# EasyEDA Pro project Sprig-C3 V1.0.1.epro, board PCB8
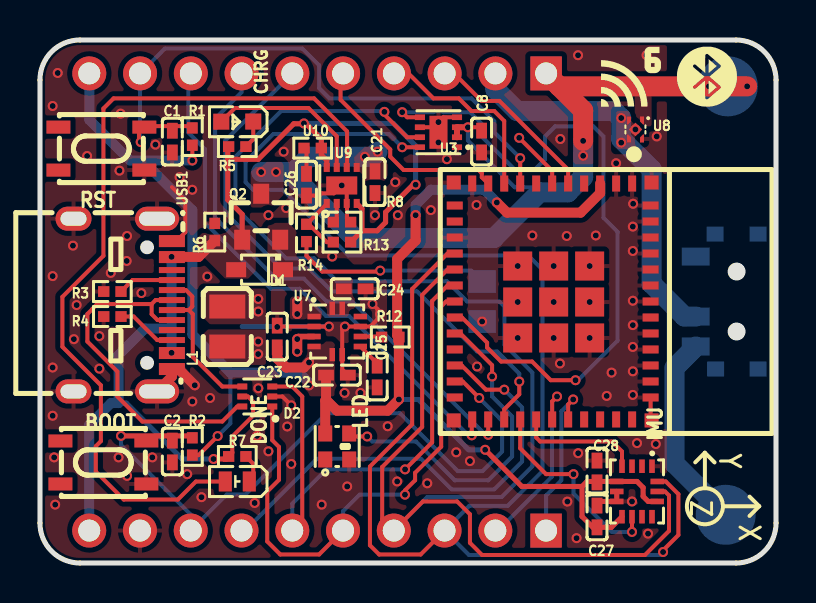
[diagram p12: board, top side]
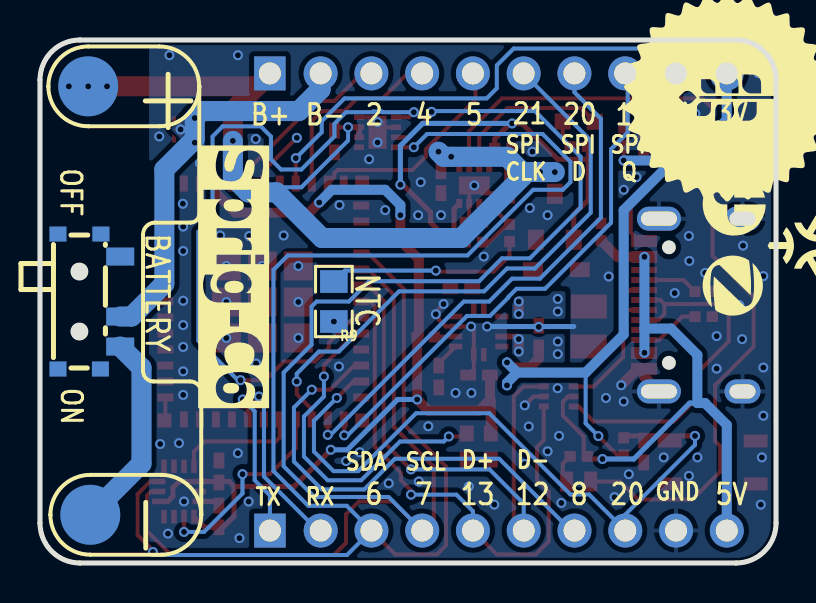
[diagram p13: board, bottom side, seen from below]

Outline 36.83 x 26.16 mm; copper layers: Top Layer, Bottom Layer. Coordinates in mm from the lower left corner of the outline.
Outline path: 0,24.16 0,2 arc(0.59,0.59) 2,0 34.83,0 arc(36.24,0.59) 36.83,2 36.83,24.16 arc(36.24,25.58) 34.83,26.16 2,26.16 arc(0.59,25.58) 0,24.16
Stack: Top Layer 0.035mm / Dielectric1 1.51mm FR4 er 4.5 / Bottom Layer 0.035mm

## Design rules (mm)
template: Custom Config
spacing copperThickness1oz (default): track to track 0.102, other pairs 0.152 to 0.3
spacing copperThickness2oz: track to track 0.203, other pairs 0.152 to 0.3
track width copperThickness1oz (default): min 0.127, default 0.254, max 2.54
track width copperThickness2oz: min 0.203, default 0.254, max 2.54
differential pair differentialPair (default): width min 0.127, default 0.254, max 2.54; gap min 0.152, default 0.152
via viaSize (default): diameter min 0.5, default 0.61, max 10; hole min 0.3, default 0.305, max 6.3
net VBAT uses solid
net VIN uses solid
net VCC uses solid
net 3.3V uses solid
net B- uses solid
net $2N1928 uses solid
net $2N1927 uses solid

## Placement (name value [footprint] x y rotation side)
BOOT  TSA016A2518C  [SW-SMD_4P-L4.2-W3.3-P2.15-LS4.6]  3.17 5.03 0 top
C1  100nF  [C0402]  6.62 21.08 90 top
C2  100nF  [C0402]  6.62 5.58 90 top
C8  100nF  [C0402]  22.1 21.08 90 top
C21  10uF  [C0402]  16.76 19.05 90 top
C22  22uF  [C0402]  14.86 9.4 180 top
C23  22uF  [C0402]  11.87 11.33 270 top
C24  22uF  [C0402]  15.75 13.72 180 top
C25  1nF  [C0402]  16.87 9.33 90 top
C26  10uF  [C0402]  13.33 18.92 90 top
C27  100nF  [C0402]  27.87 2.33 270 top
C28  100nF  [C0402]  27.87 4.58 90 top
CHRG  NCD0603O3  [LED0603-RD]  9.87 22.08 180 top
D1  1N5819WS  [SOD-323_L1.8-W1.3-LS2.5-RD]  10.99 14.67 180 top
D2  USBLC6-2P6  [SOT-666-6_L1.6-W1.2-P0.50-LS1.6-BL]  10.87 8.33 90 top
DONE  F.0603.00048/P2-0603W6YS2-06T-002  [LED-SMD_L1.6-W0.8-RD-WHITE-2]  9.87 4.08 180 top
H3  DZ254R-11-10-63  [HDR-TH_10P-P2.54-V-M]  13.89 1.62 180 top
H4  DZ254R-11-10-63  [HDR-TH_10P-P2.54-V-M]  13.9 24.49 180 top
IMU  BMI260  [LGA-14_L3.0-W2.5-P0.50-TL]  29.87 3.58 270 top
L1  1.5uH  [L0806]  9.37 11.83 90 top
LED  SK6805D-EC2018  [LED-SMD_4P-L2.0-W1.8-BL_SK6805D]  14.87 5.83 0 top
NOREF  -  [Pad_e5538]  34.31 2.41 180 top
NOREF#2  -  [Pad_e5537]  34.42 23.84 180 top
Q2  AO3401A  [SOT-23_L2.9-W1.3-P1.90-LS2.4-BR]  11.07 17.32 270 top
R1  10kΩ  [R0402]  7.62 21.33 270 top
R2  10kΩ  [R0402]  7.62 5.83 270 top
R3  5.1kΩ  [R0402]  3.62 13.58 180 top
R4  5.1kΩ  [R0402]  3.62 12.33 0 top
R5  680Ω  [R0402]  9.87 20.83 0 top
R6  10kΩ  [R0402]  8.75 16.55 270 top
R7  200Ω  [R0402]  9.87 5.33 0 top
R8  2kΩ  [R0402]  15.11 17.05 180 top
R9  FNTC0805X104F4250FB  [R0805]  22.12 13.08 90 bottom
R12  1MΩ  [R0402]  17.53 11.3 0 top
R13  100kΩ  [R0402]  15.11 16.05 180 top
R14  62kΩ  [R0402]  13.33 16.51 90 top
RST  TSA016A2518C  [SW-SMD_4P-L4.2-W3.3-P2.15-LS4.6]  3.07 20.73 0 top
SW3  MK-12C03-G015  [SW-SMD_MK-12C03-G015]  34.37 13.08 270 bottom
U1  ESP32-C6-MINI-1-N4  [WIFIM-SMD_61P-L16.6-W13.2-P0.80-ESP32-C6-MINI-1-N4]  25.65 13.08 270 top
U3  MAX17048G+T10  [DFN-8_L2.0-W2.0-P0.50-BL-EP]  19.94 21.55 90 top
U7  TPS63051RMWR  [QFN-12_L2.5-W2.5-P0.50-TL]  14.87 11.58 0 top
U8  AP6683  [DFN-4_L1.0-W1.0-P0.65-BL-EP]  29.8 21.69 180 top
U9  LGS4056H  [DFN-8_L2.0-W2.0-P0.50-TL-EP1.6]  15.1 18.89 90 top
U10  1Ω  [R0402]  13.65 20.75 180 top
USB1  U262-161N-4BVC11  [USB-3.1-SMD_U262-161N-4BVC11]  4.14 12.9 270 top

## Footprints (pads in the part's own frame, mm; a bottom-side part is the same pattern mirrored in y, then rotated)
C0402
  rect 0.79x0.54 smd: 1(-0.545,0) 2(0.545,0)
DFN-4_L1.0-W1.0-P0.65-BL-EP
  custom 0.2x0.4 smd: 1(-0.325,-0.475) 2(0.325,-0.474) 3(0.325,0.475) 4(-0.325,0.475)
  rect 0.48x0.48 smd rot 45: 5(0.004,0.001)
DFN-8_L2.0-W2.0-P0.50-BL-EP
  rect 0.28x0.505 smd: 1(-0.75,-0.927) 2(-0.25,-0.927) 3(0.25,-0.927) 4(0.75,-0.927) 5(0.75,0.927) 6(0.25,0.927) 7(-0.25,0.927) 8(-0.75,0.927)
  rect 1.65x0.9 smd: 9(0,0)
DFN-8_L2.0-W2.0-P0.50-TL-EP1.6
  rect 0.45x0.3 smd: 1(-0.9,0.75) 2(-0.9,0.25) 3(-0.9,-0.25) 4(-0.9,-0.75) 5(0.9,-0.75) 6(0.9,-0.25) 7(0.9,0.25) 8(0.9,0.75)
  rect 0.9x1.55 smd: 9(-0.001,0.002)
HDR-TH_10P-P2.54-V-M
  rect 1.575x1.7 hole 1.1: 1(-11.43,0)
  round 1.7 hole 1.1: 2(-8.89,0) 3(-6.35,0) 4(-3.81,0) 5(-1.27,0) 6(1.27,0) 7(3.81,0) 8(6.35,0) 9(8.89,0) 10(11.43,0)
L0806
  rect 1.2x1.8 smd: 1(-1,0) 2(1,0)
LED0603-RD
  rect 0.8x0.8 smd: 1(-0.799,-0.004) 2(0.799,0.004)
LED-SMD_4P-L2.0-W1.8-BL_SK6805D
  rect 0.7x0.8 smd: 1(-0.6,-0.65) 2(0.6,-0.65) 3(0.6,0.65) 4(-0.6,0.65)
LED-SMD_L1.6-W0.8-RD-WHITE-2
  rect 0.65x1 smd: 1(-0.6,0) 2(0.6,0)
LGA-14_L3.0-W2.5-P0.50-TL
  rect 0.675x0.28 smd: 1(-1.262,0.75) 2(-1.262,0.25) 3(-1.262,-0.25) 4(-1.262,-0.75) 8(1.262,-0.75) 9(1.262,-0.25) 10(1.262,0.25) 11(1.262,0.75)
  rect 0.28x0.675 smd: 5(-0.5,-1.012) 6(0,-1.012) 7(0.5,-1.012) 12(0.5,1.012) 13(0,1.012) 14(-0.5,1.012)
Pad_e5537
  round 3 smd far side: 1(0,0)
Pad_e5538
  round 3 smd far side: 2(0,0)
QFN-12_L2.5-W2.5-P0.50-TL
  rect 0.665x0.28 smd: 1(-1.157,0.75) 2(-1.157,0.25) 3(-1.157,-0.25) 4(-1.157,-0.75) 7(1.157,-0.75) 8(1.157,-0.25) 9(1.157,0.25) 10(1.157,0.75)
  rect 0.28x0.665 smd: 5(-0.25,-1.157) 6(0.25,-1.157) 11(0.25,1.157) 12(-0.25,1.157)
R0402
  rect 0.566x0.54 smd: 1(-0.433,0) 2(0.433,0)
R0805
  rect 1.133x1.377 smd: 1(-1,0) 2(1,0)
SOD-323_L1.8-W1.3-LS2.5-RD
  rect 1x0.75 smd: 1(-1.173,0) 2(1.173,0)
SOT-23_L2.9-W1.3-P1.90-LS2.4-BR
  rect 1x0.8 smd: 1(1.15,-0.95) 2(1.15,0.95) 3(-1.15,0)
SOT-666-6_L1.6-W1.2-P0.50-LS1.6-BL
  rect 0.3x0.5 smd: 1(-0.5,-0.75) 2(0,-0.75) 3(0.5,-0.75) 4(0.5,0.75) 5(0,0.75) 6(-0.5,0.75)
SW-SMD_4P-L4.2-W3.3-P2.15-LS4.6
  rect 1.2x0.65 smd: 1(-2.15,1.075) 2(2.15,1.075) 3(-2.15,-1.075) 4(2.15,-1.075)
SW-SMD_MK-12C03-G015
  rect 0.9x1.4 smd: 1(-2.251,1.558) 2(0.75,1.558) 3(2.25,1.558)
  rect 0.75x0.85 smd: 4(-3.375,0.592) 5(-3.375,-1.558) 6(3.375,0.567) 7(3.375,-1.558)
USB-3.1-SMD_U262-161N-4BVC11
  rect 0.6x1.3 smd: A1B12(-3.2,2.462) A4B9(-2.4,2.462) B1A12(3.2,2.462) B4A9(2.4,2.462)
  rect 0.3x1.3 smd: A5(-1.25,2.462) A6(-0.25,2.462) A7(0.25,2.462) A8(1.25,2.462) B5(1.75,2.462) B6(0.75,2.462) B7(-0.75,2.462) B8(-1.75,2.462)
  oval 1.2x2.2 hole 0.7x1.8: SHELL(-4.32,1.719) SHELL(4.32,1.719)
  oval 1.2x1.8 hole 0.7x1.3: SHELL(-4.32,-2.462) SHELL(4.32,-2.462)
WIFIM-SMD_61P-L16.6-W13.2-P0.80-ESP32-C6-MINI-1-N4
  rect 0.8x0.4 smd: 1(-5.9,3.975) 2(-5.9,3.175) 3(-5.9,2.375) 4(-5.9,1.575) 5(-5.9,0.775) 6(-5.9,-0.025) 7(-5.9,-0.825) 8(-5.9,-1.625) 9(-5.9,-2.425) 10(-5.9,-3.225) 11(-5.9,-4.025) 25(5.9,-4.025) 26(5.9,-3.225) 27(5.9,-2.425) 28(5.9,-1.625) 29(5.9,-0.825) 30(5.9,-0.025) 31(5.9,0.775) 32(5.9,1.575) 33(5.9,2.375) 34(5.9,3.175) 35(5.9,3.975)
  rect 0.4x0.8 smd: 12(-4.8,-4.9) 13(-4,-4.9) 14(-3.2,-4.9) 15(-2.4,-4.9) 16(-1.6,-4.9) 17(-0.8,-4.9) 18(0,-4.9) 19(0.8,-4.9) 20(1.6,-4.9) 21(2.4,-4.9) 22(3.2,-4.9) 23(4,-4.9) 24(4.8,-4.9) 36(4.8,4.9) 37(4,4.9) 38(3.2,4.9) 39(2.4,4.9) 40(1.6,4.9) 41(0.8,4.9) 42(0,4.9) 43(-0.8,4.9) 44(-1.6,4.9) 45(-2.4,4.9) 46(-3.2,4.9) 47(-4,4.9) 48(-4.8,4.9)
  rect 1.45x1.45 smd: 49(-1.775,1.85) 49(-1.775,0.05) 49(-1.775,-1.75) 49(0.025,1.85) 49(0.025,0.05) 49(0.025,-1.75) 49(1.825,1.85) 49(1.825,0.05) 49(1.825,-1.75)
  rect 0.7x0.7 smd: 50(5.95,4.95) 51(5.95,-4.95) 52(-5.95,-4.95) 53(-5.95,4.95)

## Nets
3.3V: C22.2 C23.2 C27.2 C28.1 H4.10 IMU.5 IMU.8 IMU.12 LED.4 R1.2 R2.2 R12.2 U1.3 U7.4 U7.5
GND: BOOT.4 C1.1 C2.1 C8.1 C21.1 C22.1 C23.1 C24.1 C25.1 C26.1 C27.1 C28.2 D2.2 H3.9 IMU.1 IMU.6 IMU.7 LED.2 R3.2 R4.1 R6.1 R8.1 R9.1 RST.4 U1.1 U1.2 U1.11 U1.14 U1.36 U1.37 U1.38 U1.39 U1.40 U1.41 U1.42 U1.43 U1.44 U1.45 U1.46 U1.47 U1.48 U1.49 U1.50 U1.51 U1.52 U1.53 U3.1 U3.4 U3.6 U3.9 U7.2 U7.6 U7.9 U8.4 U9.3 U9.9 USB1.A1B12 USB1.B1A12 USB1.SHELL
VBAT: C8.2 C21.2 H4.1 NOREF#2.1 Q2.3 U3.2 U3.3 U8.1 U9.5
VCC: D1.2 D2.5 H3.10 Q2.1 R5.1 R6.2 R7.1 R13.1 U9.4 U9.8 U10.1 USB1.A4B9 USB1.B4A9
VIN: C24.2 D1.1 Q2.2 U7.11 U7.12
ALRT: U1.19 U3.5
B-: H4.2 SW3.2 U8.2 U8.3 U8.5
B-_C: NOREF.2 SW3.3
BUSY: U1.12
D02: H4.3 U1.5
D04: H4.4 U1.9
D05: H4.5 U1.10
D08: H3.7 U1.22
D09: BOOT.2 C2.2 H3.8 R2.1 U1.23
D15: LED.3 U1.20
D22: IMU.9 U1.28
D23: IMU.4 U1.29
D+: D2.1 H3.5 U1.18
D-: D2.3 H3.6 U1.17
DIO1: U1.13
DN1: D2.4 USB1.A7 USB1.B7
DP1: D2.6 USB1.A6 USB1.B6
EN: C1.2 H4.9 R1.1 RST.2 U1.8
RESET: U1.6
RX: H3.2 U1.30
SCL: H3.4 IMU.13 U1.16 U3.7
SDA: H3.3 IMU.14 U1.15 U3.8
SPICLK: H4.6 U1.27
SPICS2: U1.24
SPID: H4.7 U1.26
SPIQ: H4.8 U1.25
TX: H3.1 U1.31
$2N1916: R3.1 USB1.A5
$2N1918: R4.2 USB1.B5
$2N1927: L1.1 U7.3
$2N1928: L1.2 U7.1
$2N1932: R12.1 U7.8
$2N1935: C25.2 U7.7
$2N1945: C26.2 U10.2
$2N1946: R8.2 U9.2
$2N1948: R13.2 R14.2 U9.1
$2N1949: R9.2 R14.1
$2N1952: CHRG.2 U9.7
$2N1954: DONE.1 R7.2
$2N1955: DONE.2 U9.6
$2N1959: CHRG.1 R5.2

Pads without a net: BOOT 1 3; IMU 2 3 10 11; LED 1; RST 1 3; SW3 1 4 5 6 7; U1 4 7 21 32 33 34 35; U7 10; USB1 A8 B8

## Via types
v1: diameter 0.5, hole 0.3, Top Layer to Bottom Layer, 159 vias

## Routing (per net, layer and track width the routed paths; a pad name or vN(x,y) marks a point on that pad's centre or on a via; arc(x,y) is an arc through that point)
3.3V: length 81.6
  Top Layer w0.2: R2.2 7.94,5.4 v1(8.89,6.35) ; R1.2 v1(7.62,20.13)
  Top Layer w0.254: IMU.8 28.59,1.78 C27.2 27.67,1.78 27.12,2.33 27.12,3.83 ; IMU.12 30.43,3.08 30.18,3.33 30.18,3.77 29.87,4.08 IMU.5 27.92,4.08 C28.1 27.83,4.08 27.37,4.08 27.12,3.83 ; v1(22.28,5.66) 24.11,3.83 27.12,3.83
  Top Layer w0.5: 14.31,8.16 14.86,7.62 17.4,7.62 v1(17.96,8.18) R12.2 17.87,11.39 17.87,15.21 18.8,16.13 v1(18.8,17.4) ; 14.31,8.16 C22.2 ; 14.31,8.16 14.27,8.12 LED.4 ; U1.3 28.03,18.5 27.05,17.53 23.37,17.53 v1(22.86,18.03) ; C23.2 11.87,10.22 12.32,9.78 13.21,9.78 v1(13.46,10.03)
  Bottom Layer w0.2: 9.52,9.52 9.52,6.98 v1(8.89,6.35)
  Bottom Layer w0.254: v1(17.96,8.18) 18.93,8.18 21.45,5.66 v1(22.28,5.66)
  Bottom Layer w0.5: 5.14,20.13 7.62,17.65 7.62,11.43 9.52,9.52 12.95,9.52 ; 5.14,20.13 4.5,20.13 2.47,22.17 H4.10 ; 5.14,20.13 v1(7.62,20.13) ; v1(22.86,18.03) 22.22,18.67 19.56,18.67 18.8,17.91 v1(18.8,17.4) ; 12.95,9.52 13.46,9.02 v1(13.46,8.89) ; 12.95,9.52 v1(13.46,10.03)
GND: length 28.1
  Top Layer w0.2: v1(12.57,7.89) 12.13,8.33 D2.2 ; U3.6 19.69,21.8 U3.9 ; R8.1 15.36,17.23 15.36,17.98 U9.3 15.35,18.63 v1(15.1,18.89) 14.7,18.49 14.08,18.49 13.97,18.38 C26.1 ; 15.4,9.4 15.12,9.68 U7.6 15.12,11.69 v1(15.26,11.83) U7.9 16.53,11.83 16.89,12.19 16.89,12.7 v1(16.64,12.95) ; U1.36 30.55,7.18 U1.50 ; 6.6,18.8 7.27,18.13 7.27,16.54 6.84,16.11 6.58,16.11 ; v1(14.46,11.83) U7.2 11.92,11.83 C23.1 ; U3.4 20.18,22.3 v1(19.94,22.05)
  Top Layer w0.254: C27.1 28.08,3.08 IMU.7 IMU.6
  Top Layer w0.5: 6.92,9.71 v1(7.75,8.89) ; USB1.SHELL 6.6,9.33 USB1.B1A12 ; 6.58,9.71 6.6,9.71
  Bottom Layer w0.254: 10.12,11.83 v1(14.46,11.83)
  vias: v1(0.63,22.86) v1(0.63,14.35) v1(0.63,9.78) v1(0.63,7.37) v1(0.71,5.28) v1(0.76,2.92) v1(0.89,24.51) v1(1.65,15.88) v1(1.7,11.2) v1(1.83,12.9) v1(2.36,20.36) v1(2.97,11.35) v1(2.97,9.72) v1(3.54,14.51) v1(3.98,19.63) v1(3.93,5.28) v1(4.04,22.48) v1(4.36,16.36) v1(4.34,15.11) v1(4.36,4.36) v1(5.07,13.5) v1(5.62,5.28) v1(5.78,20.93) v1(6.98,19.3) v1(7.37,4.44) v1(7.62,18.67) v1(7.62,8.08) v1(8.08,3.29) v1(8.37,14.33) v1(8.51,8.25) v1(10.74,3) v1(10.86,6.36) v1(10.93,8.74) v1(11.43,17.4) v1(11.43,5.59) v1(11.87,11.81) v1(12.19,20.57) v1(12.32,17.75) v1(12.37,6.83) v1(12.57,4.95) v1(14.1,2.92) v1(14.62,15.33) v1(15.24,8.51) v1(15.37,3.83) v1(16.03,8.51) v1(16.76,17.4) v1(17.02,12.45) v1(17.4,6.84) v1(17.78,19.05) v1(17.91,17.4) v1(17.87,4.08) v1(19.38,3.99) v1(19.56,17.65) v1(19.94,21.04) v1(20.36,20.2) v1(20.83,5.54) v1(21.51,5.1) v1(21.84,17.91) v1(21.87,9.83) v1(22.12,12.08) v1(23.9,14.86) v1(23.9,13.06) v1(23.9,11.26) v1(24.64,16.38) v1(25.7,14.86) v1(25.7,13.06) v1(25.7,11.26) v1(26.02,9.98) v1(26.03,21.21) v1(26.36,16.36) v1(26.39,3.07) v1(26.85,1.24) v1(26.92,25.4) v1(26.93,5.49) v1(27.5,14.86) v1(27.5,13.06) v1(27.5,11.26) v1(27.81,16.38) v1(28.36,8.36) v1(28.6,9.52) v1(28.83,20) v1(29.68,17.97) v1(29.66,16.83) v1(29.66,15.61) v1(29.66,13.12) v1(29.66,11.9) v1(29.66,10.81) v1(29.66,9.59) v1(29.66,8.41) v1(29.62,3.08) v1(29.87,6) v1(30.35,25.4) v1(30.42,1.47) v1(30.82,5.95) v1(30.86,21.34)
VBAT: length 46
  Top Layer w0.2: v1(21.41,21.8) 21.93,21.8 C8.2
  Top Layer w0.3: U3.2 U3.3 v1(21.41,21.8)
  Top Layer w1: 25.98,23.84 27.18,22.64 v1(27.18,21.11) ; 25.98,23.84 H4.1 ; 25.98,23.84 v1(33.47,23.84) v1(34.42,23.84) v1(35.38,23.84)
  Bottom Layer w0.2: v1(21.41,21.8) 21.41,21.13 23.75,18.8 25.02,18.8
  Bottom Layer w1: 12.45,19.56 v1(11.81,19.56) 11.81,19.55 v1(11.07,19.55) ; 12.45,19.56 12.7,19.56 13.46,20.32 v1(16.26,20.32) 16.64,20.32 v1(16.89,20.57) ; 12.45,19.56 15.75,16.26 22.72,16.26 25,18.54 26.42,18.54 27.18,19.3 v1(27.18,20.37) v1(27.18,21.11)
VCC: length 57.2
  Top Layer w0.2: D2.5 10.41,8.33 10.66,8.07 10.66,7.37 9.62,6.33 9.62,5.51 R7.1
  Top Layer w0.254: U9.8 14.35,20.15 14.08,20.42 U10.1 14.08,21.21 13.32,21.97 12.7,21.97 10.92,20.19 9.4,20.19 ; R5.1 9.4,20.79 9.4,18.16 10.12,17.44 Q2.1 ; 16.11,16.62 16.87,16.62 17.29,17.04 17.29,17.55 18.67,18.92 v1(18.8,18.92) ; 16.11,16.62 R13.1 ; 16.11,16.62 16.11,17.73 U9.4 ; R7.1 9.31,5.2 v1(8.69,5.2)
  Top Layer w0.5: R6.2 7.94,15.31 v1(6.58,15.31)
  Bottom Layer w0.254: v1(18.8,18.92) 18.8,20.87 17.68,21.99 v1(13.21,21.99) ; v1(8.69,5.2) 7.12,5.2 4.32,8 3.94,8
  Bottom Layer w0.5: v1(6.58,15.31) 6.58,11.73 ; 6.58,11.73 v1(6.58,10.51) ; 6.58,11.73 5.25,11.73 3.94,10.41 3.94,8 3.56,8 2.46,6.91 2.46,1.62
ALRT: length 35.3
  Top Layer w0.2: v1(18.12,22.55) 18.38,22.3 U3.5 ; U1.19 21.11,12.28 22.37,11.02 22.37,10.78 23.07,10.08 24.62,10.08 25.56,9.14 v1(26.8,9.14)
  Bottom Layer w0.2: v1(18.12,22.55) 19.69,22.55 19.72,22.58 20.16,22.58 20.19,22.55 21.52,22.55 22.1,21.97 22.1,21.34 23.75,19.68 24.76,19.68 25.27,20.19 25.27,21.34 25.78,21.84 27.69,21.84 28.19,21.34 28.19,17.27 28.91,16.56 28.91,11.12 26.92,9.14 v1(26.8,9.14)
B-: length 19.5
  Bottom Layer w1: SW3.2 32.25,12.33 30.61,13.97 30.61,19.68 29.08,21.21 v1(29.08,22.26) 28.74,22.61 23.88,22.61 22.79,23.69 H4.2
  vias: v1(29.08,21.03) v1(29.79,21.69)
B-_C: length 9.9
  Bottom Layer w1: NOREF.2 31.75,4.97 31.75,9.76 SW3.3
D02: length 8.9
  Top Layer w0.2: U1.5 26.43,19.67 22.99,23.11 22.1,23.11 20.72,24.49 H4.3
D04: length 9.6
  Top Layer w0.2: H4.4 18.44,24.49 19.69,23.24 20.95,23.24 21.59,22.61 22.73,22.61 23.23,22.11 U1.9
D05: length 10.8
  Top Layer w0.2: H4.5 15.04,24.36 15.04,23.17 17.53,20.69 17.53,20.33 18.19,19.66 21.94,19.66 22.11,19.5 22.11,19.29 22.42,18.98 U1.10
D08: length 23.7
  Top Layer w0.2: U1.22 21.1,9.88 22.31,8.67 v1(23.23,8.67)
  Bottom Layer w0.2: v1(23.23,8.67) 24.12,7.78 24.12,5.08 22.73,3.68 20.6,3.68 19.07,5.21 13.85,5.21 10.26,1.62 10.08,1.62
D09: length 34.1
  Top Layer w0.2: U1.23 21.15,9.08 v1(21.98,8.25)
  Top Layer w0.254: R2.1 7.53,6.36 v1(4.05,6.36)
  Bottom Layer w0.2: v1(21.98,8.25) 23.12,7.11 23.12,5.58 22.14,4.6 20.9,4.6 18.01,7.49 14.35,7.49 10.29,3.43 9.35,3.43 H3.8 7.54,2.42 4.05,5.91 v1(4.05,6.36)
D15: length 17.1
  Top Layer w0.2: v1(16.37,6.33) 15.62,6.33 LED.3 ; v1(22.62,9.33) 22.62,9.89 21.04,11.48 U1.20
  Bottom Layer w0.2: v1(22.62,9.33) 22.62,8.33 23.62,7.33 23.62,5.33 22.43,4.14 20.75,4.14 18.81,6.08 16.62,6.08 v1(16.37,6.33)
D22: length 10.1
  Top Layer w0.2: U1.28 24.03,5.74 25.32,4.44 v1(26.7,4.44) ; IMU.9 v1(29.62,1.55)
  Bottom Layer w0.2: v1(29.62,1.55) 28.62,1.55 26.7,3.48 v1(26.7,4.44)
D23: length 6.2
  Top Layer w0.2: IMU.4 29.12,5.58 28.62,6.08 25.03,6.08 24.83,6.28 U1.29
D+: length 27
  Top Layer w0.2: v1(18.26,3.42) 18.26,3.63 18.77,4.14 18.77,4.51 20.07,5.82 20.07,12.84 20.32,13.08 U1.18 ; D2.1 11.62,6.14 11.96,5.81 11.96,4.16 11.37,3.57 11.37,1.08 12.02,0.43 13.97,0.43 H3.5
  Bottom Layer w0.2: H3.5 15.16,2.59 15.99,3.42 v1(18.26,3.42)
D-: length 26.8
  Top Layer w0.2: D2.3 12.62,8.83 13.12,8.33 13.12,2.12 12.62,1.62 ; U1.17 20.39,13.88 19.62,13.11 19.62,6.04 v1(18.27,4.68)
  Bottom Layer w0.2: 12.62,1.62 12.62,2.97 14.34,4.68 v1(18.27,4.68)
DN1: length 8.3
  Top Layer w0.2: 7.45,12.65 7.62,12.83 7.62,13.33 7.3,13.65 USB1.B7 ; 7.45,12.65 7.65,12.45 7.65,10.31 9.12,8.83 D2.4 ; 7.45,12.65 USB1.A7
DP1: length 18
  Top Layer w0.2: 5.59,12.95 2.87,12.95 2.8,12.88 2.79,12.88 2.63,12.71 2.63,12.71 2.37,12.45 2.37,11.08 3.87,9.58 3.87,8.33 5.12,7.08 9.12,7.08 9.87,7.83 D2.6 ; 5.59,12.95 5.79,13.15 USB1.A6 ; 5.59,12.95 5.59,12.45 5.88,12.15 USB1.B6
EN: length 30.9
  Top Layer w0.2: U1.8 v1(24.03,20.25) ; R1.1 7.53,21.85 5.22,21.85 4.95,21.58 4.95,21.14 v1(5.04,21.06)
  Bottom Layer w0.2: v1(5.04,21.06) 5.01,21.09 H4.9 6.25,25.73 13.13,25.73 13.97,24.89 13.97,23.75 14.48,23.24 21.59,23.24 22.73,22.1 22.73,21.55 v1(24.03,20.25)
RESET: length 3
  Top Layer w0.2: v1(23.98,21.27) 25.63,19.62 U1.6
RX: length 9.3
  Top Layer w0.2: U1.30 25.63,8.08 v1(25.87,8.33)
  Bottom Layer w0.2: v1(25.87,8.33) 25.62,8.08 25.62,4.33 22.92,1.62 H3.2
SCL: length 80
  Top Layer w0.2: U3.7 18.37,21.3 17.23,22.43 v1(17.23,22.57) ; U1.16 20.39,14.68 19.12,13.41 19.12,6.8 17.12,4.8 17.12,2.2 H3.4 19.16,3.08 20.87,3.08 21.51,2.44 21.51,1.01 22.12,0.4 30.27,0.4 31.47,1.6 31.47,3.38 31.27,3.58 IMU.13
  Bottom Layer w0.2: v1(17.23,22.57) 17.19,22.61 12.06,22.61 9.78,20.32 9.78,17.78 12.32,15.24 13.72,15.24 14.86,14.1 20.35,14.1 21.37,13.08 22.99,13.08 23.24,12.83 23.24,10.92 24.64,9.52 24.64,4.84 23.1,3.3 19.38,3.3 H3.4
SDA: length 80.5
  Top Layer w0.2: v1(31.18,0.55) 31.18,0.63 31.94,1.4 31.94,3.44 31.31,4.08 IMU.14 ; U1.15 20.39,15.48 18.62,13.71 18.62,6.94 16.51,4.83 16.51,0.89 16.97,0.43 19.05,0.43 20.24,1.62 ; U3.8 v1(18.12,20.8)
  Bottom Layer w0.2: v1(18.12,20.8) 17.46,21.46 11.68,21.46 10.29,20.07 10.29,19.05 10.67,18.67 12.15,18.67 15.44,15.38 24.43,15.38 25.15,14.67 25.15,4.6 23.41,2.86 21.48,2.86 20.24,1.62 21.47,0.4 31.03,0.4 v1(31.18,0.55)
SPICLK: length 29
  Top Layer w0.2: U1.27 23.23,7.68 23.98,8.44 v1(23.98,9.08)
  Bottom Layer w0.2: v1(23.98,9.08) 23.98,9.47 22.87,10.58 21.87,10.58 18.86,13.59 14.6,13.59 13.46,14.73 12.06,14.73 9.27,17.53 9.27,21.13 H4.6
SPID: length 26.7
  Top Layer w0.2: U1.26 v1(22.43,6.41)
  Bottom Layer w0.2: v1(22.43,6.41) 22.29,6.41 15.62,13.08 14.35,13.08 13.21,14.22 11.81,14.22 8.76,17.27 8.76,22.22 10.09,23.55 H4.7
SPIQ: length 26.4
  Top Layer w0.2: v1(21.6,6.39) 21.6,7.16 U1.25
  Bottom Layer w0.2: H4.8 7.42,24.36 7.42,21.53 8.25,20.7 8.25,17.02 11.56,13.72 12.98,13.72 13.4,13.3 13.4,13.27 14.31,12.36 15.46,12.36 21.44,6.39 v1(21.6,6.39)
TX: length 8.2
  Top Layer w0.2: v1(26.68,8.18) 26.43,7.93 U1.31
  Bottom Layer w0.2: H3.1 25.32,3.38 26.09,4.14 26.09,7.59 v1(26.68,8.18)
$2N1916: length 2.8
  Top Layer w0.2: USB1.A5 4.63,14.15 R3.1
$2N1918: length 3
  Top Layer w0.2: R4.2 4.69,12.33 5.86,11.15 USB1.B5
$2N1927: length 1.5
  Top Layer w0.28: 12.87,11.27 12.93,11.33 U7.3
  Top Layer w0.5: v1(12.87,10.58) v1(12.87,11.2)
  vias: v1(10.92,11.08) v1(10.92,10.45)
$2N1928: length 0.6
  Top Layer w0.5: v1(12.87,13.08) v1(12.87,12.46)
  vias: v1(10.92,13.21) v1(10.92,12.58)
$2N1932: length 1.1
  Top Layer w0.2: U7.8 17.07,11.33 R12.1
$2N1935: length 1.3
  Top Layer w0.2: C25.2 16.87,9.99 U7.7
$2N1945: length 1.3
  Top Layer w0.2: U10.2 13.33,20.63 C26.2
$2N1946: length 1
  Top Layer w0.2: R8.2 14.85,17.22 U9.2
$2N1948: length 3.2
  Top Layer w0.2: U9.1 14.35,17.96 R14.2 13.46,16.94 14.35,16.05 R13.2
$2N1949: length 10.1
  Top Layer w0.2: v1(17.02,14.63) 16.97,14.58 14.12,14.58 13.33,15.37 R14.1
  Bottom Layer w0.2: v1(17.02,14.63) 21.58,14.63 R9.2
$2N1952: length 8.2
  Top Layer w0.2: U9.7 14.85,21.34 13.43,22.76 9.76,22.76 CHRG.2
$2N1954: length 1.4
  Top Layer w0.2: R7.2 10.67,4.96 10.67,4.08
$2N1955: length 42
  Top Layer w0.2: U9.6 15.37,19.8 15.37,21.59 13.72,23.24 3.68,23.24 3.17,22.73 3.17,15.37 1.12,13.31 1.12,10.81 3.05,8.89 3.05,6.1 2.79,5.84 2.79,4.57 4.19,3.17 6.9,3.17 7.8,4.08 9.07,4.08
$2N1959: length 1.4
  Top Layer w0.2: CHRG.1 10.67,21.2 R5.2

## Copper pours and planes (outline as drawn; the poured copper is in the pictures)
3.3V on Top Layer: 13.12,10.83 13.37,11.08 14.62,11.08 14.87,10.83 14.87,8.34 13.12,8.34
GND on Top Layer: -2.29,30.35 30.1,30.35 31.37,29.08 31.37,-0.25 29.59,-2.03 -5.33,-2.03 -6.73,-3.43 -6.73,25.91
GND on Bottom Layer: -3.18,34.16 26.29,34.16 31.37,29.08 31.37,-0.89 22.86,-9.4 -2.16,-9.4 -3.18,-8.38
VBAT on Top Layer: 15.62,19.43 15.97,19.43 16.4,19 17.17,19 17.39,19.23 17.39,20.71 17.27,20.83 16.26,20.83 15.62,20.19
VBAT on Top Layer: 10.54,17.78 11.56,17.78 12.19,18.41 12.19,19.94 12.06,20.07 11.05,20.07 10.54,19.56
VBAT on Top Layer: 29.76,22.29 30.21,21.84 30.61,21.84 30.61,24.26 29.76,24.26
VBAT on Top Layer: 26.67,21.46 27.69,21.46 27.69,19.94 26.8,19.94 26.67,20.07
VCC on Top Layer: 8.13,16.51 9.27,16.51 9.65,16.89 10.54,16.89 10.79,16.64 10.79,14.6 10.41,14.22 9.27,14.22 7.87,15.62 7.87,16.26
VIN on Top Layer: 14.37,12.33 15.75,12.33 15.75,14.44 14.37,14.44
VIN on Top Layer: 11.38,16.84 11.56,17.02 12.45,17.02 12.84,16.63 12.84,15.35 13.2,14.99 15.28,14.99 15.75,14.51 15.75,12.64 15.44,12.33 14.36,12.33 14.35,12.32 14.35,12.34 13.37,13.32 12.91,13.32 12.28,13.95 11.71,13.95 11.38,14.27
B- on Top Layer: 30.23,21.69 29.84,22.07 29.84,22.61 28.83,22.61 28.83,20.7 29.84,20.7 29.84,21.3
B- on Bottom Layer: 28.57,20.57 29.17,20.57 30.29,21.7 29.26,22.73 28.7,22.73 28.57,22.61
$2N1927 on Top Layer: 11.3,11.68 8.4,11.68 8.17,11.46 8.17,9.91 11.3,9.91
$2N1927 on Bottom Layer: 13.21,10.41 12.83,10.03 10.57,10.03 10.57,11.68 13.2,11.68 13.21,11.68
$2N1928 on Top Layer: 8.51,11.94 8.17,12.27 8.17,13.69 8.21,13.73 11.29,13.73 11.3,13.72 11.3,11.94
$2N1928 on Top Layer: 14.12,12.08 14.12,12.57 13.36,13.33 12.62,13.33 12.5,13.21 12.5,12.21 12.75,11.95 13.12,11.95 13.25,12.08
$2N1928 on Bottom Layer: 13.21,13.21 13.21,11.94 10.54,11.94 10.54,13.59 12.83,13.59

Small or netless copper shapes (teardrops, artwork), in the pictures only: 1 on Top Layer

## Text on the board
Bottom Silkscreen Layer: GND | SPI / Q | SPI / D | D- | SPI / CLK | D+ | SCL | SDA | RX | TX | ON | OFF | 19 | 20 | 21 | 5 | 4 | 2 | B- | B+ | 5V | 3V | EN | 8 | 12 | 13 | 7 | 6 | NTC | BATTERY | + | - | Sprig-C6
Top Silkscreen Layer: Z | X | Y
